# EAGLE design SinclairScientific (EAGLE 9.2.0)
AUTHOR: w. boyett; CONTACT_COMPANY: Pacific Light & Hologram; LICENSE: CC-BY-SA; REV: 1C

## Sheet 1 of 2
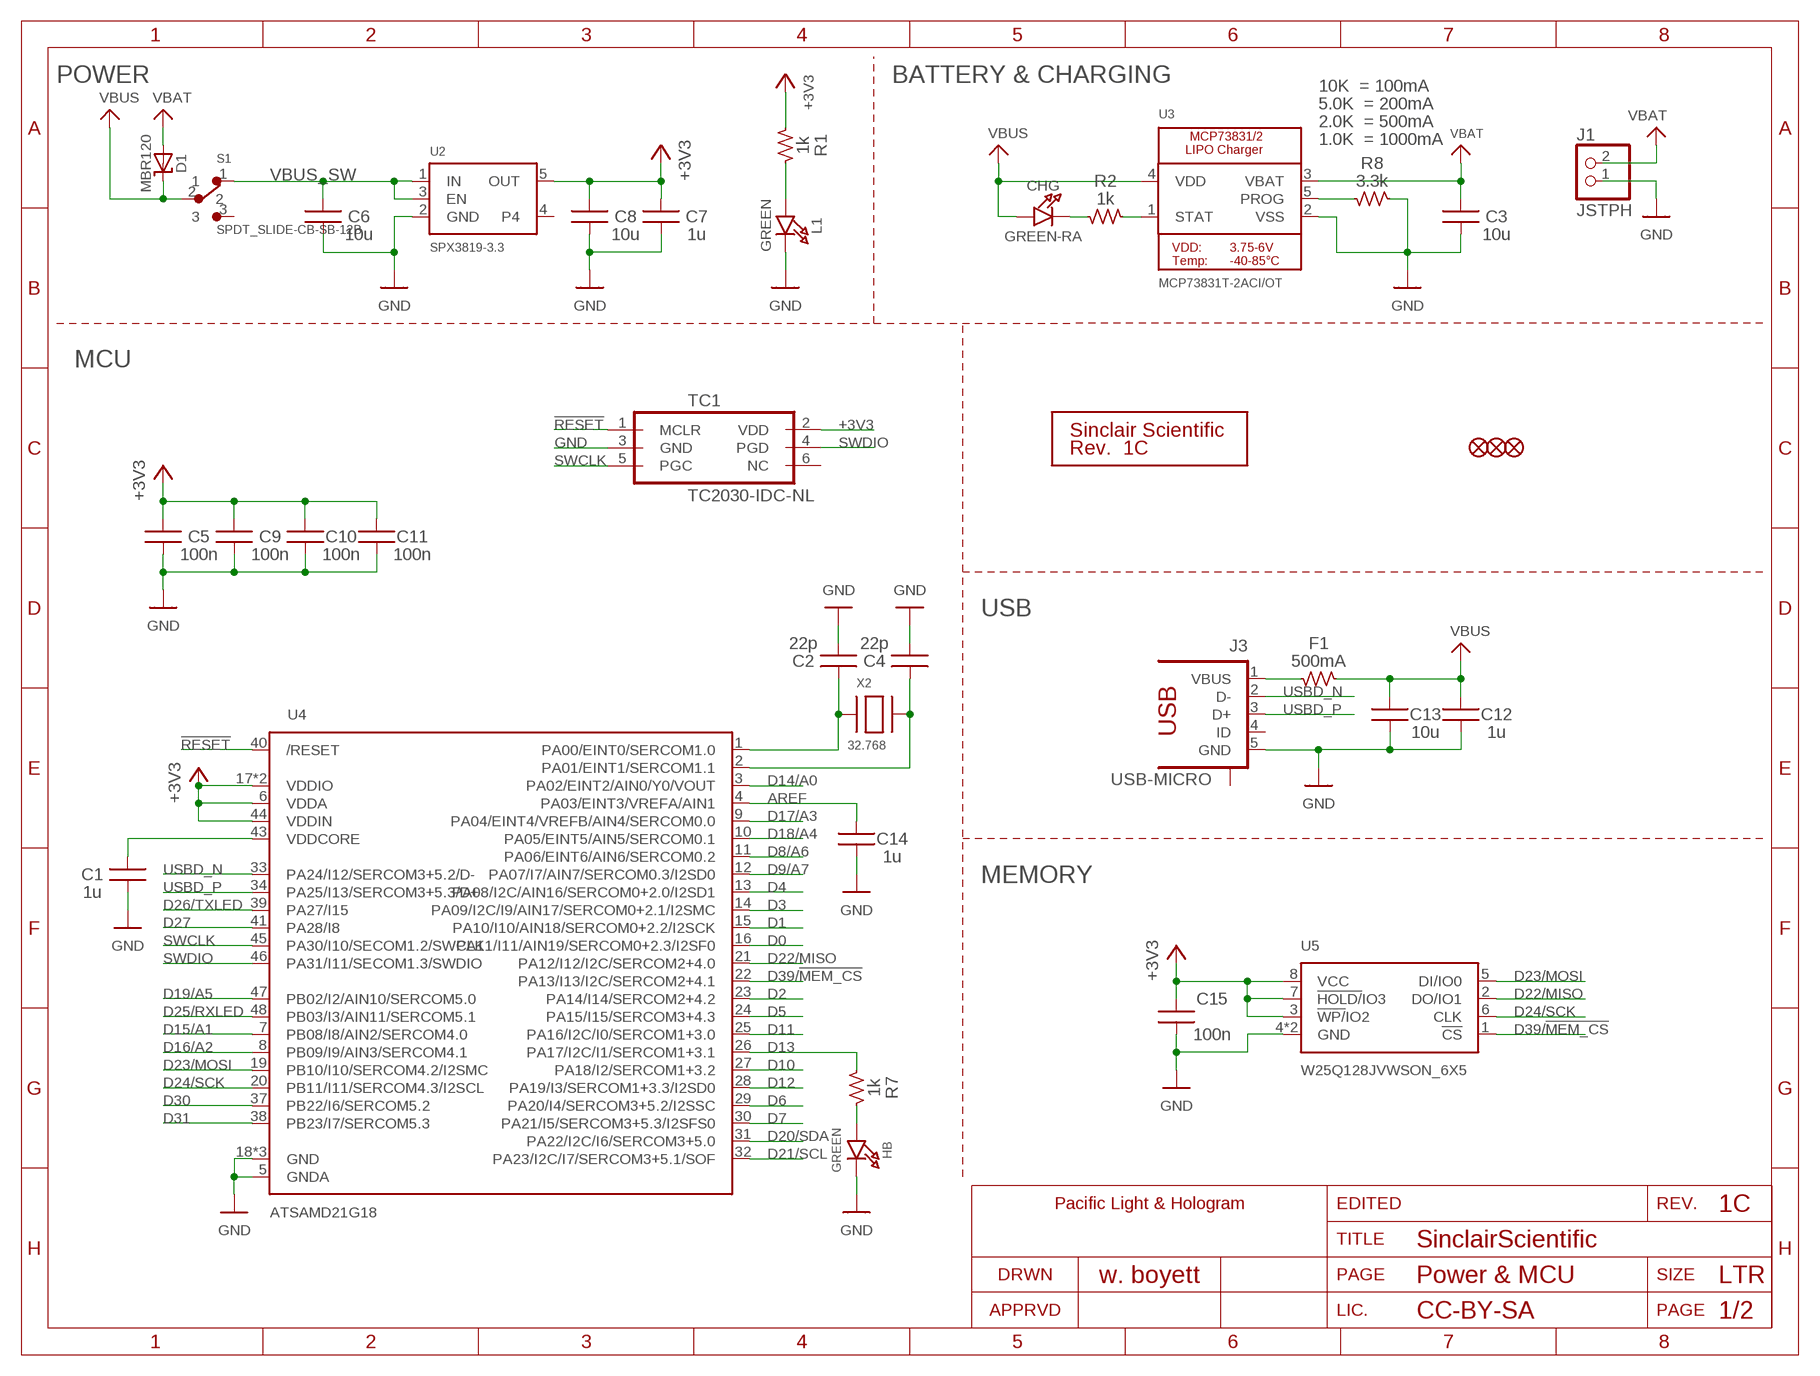
[diagram p0: schematic, sheet 1]
FRAME1 (LETTER_L): SECTION: Power & MCU

### Parts
C1  1u  C-USC0603  [C0603]
C2  22p  C-USC0603  [C0603]
C3  10u  C-USC0805  [C0805]
C4  22p  C-USC0603  [C0603]
C5  100n  C-USC0603  [C0603]
C6  10u  C-USC0805  [C0805]
C7  1u  C-USC0603  [C0603]
C8  10u  C-USC0805  [C0805]
C9  100n  C-USC0603  [C0603]
C10  100n  C-USC0603  [C0603]
C11  100n  C-USC0603  [C0603]
C12  1u  C-USC0603  [C0603]
C13  10u  C-USC0805  [C0805]
C14  1u  C-USC0603  [C0603]
C15  100n  C-USC0603  [C0603]
CHG  GREEN-RA  LED0805_NOOUTLINE  [CHIPLED_0805_NOOUTLINE]
D1  MBR120  DIODE-SCHOTTKYSOD-123  [SOD-123]
F1  500mA  R-US_R0805  [R0805]
FID1  FIDUCIAL""  [FIDUCIAL_1MM]
FID2  FIDUCIAL""  [FIDUCIAL_1MM]
FID3  FIDUCIAL""  [FIDUCIAL_1MM]
HB  GREEN  LED0805_NOOUTLINE  [CHIPLED_0805_NOOUTLINE]
J1  JSTPH  CON_JST_PH_2PIN  [JSTPH2]
J3  USB-MICRO  [USB-10118192-0001LF]
L1  GREEN  LED0805_NOOUTLINE  [CHIPLED_0805_NOOUTLINE]
R1  1k  R-US_R0603  [R0603]
R2  1k  R-US_R0603  [R0603]
R7  1k  R-US_R0603  [R0603]
R8  3.3k  R-US_R0603  [R0603]
S1  SPDT_SLIDE-CB-SB-12B  [CL-SB-12B]
SILK-QC  SILK_QC  [SILK_QC]
TC1  TC2030-IDC-NL  [TC2030-IDC-NL]
U2  SPX3819-3.3  VREG_SOT23-5  [SOT23-5]
U3  MCP73831T-2ACI/OT  MCP73831/2  [SOT23-5]
U4  ATSAMD21G18  ATSAMD21J_QFP  [TQFP48_7MM]
U5  W25Q128JVWSON_6X5  [SON127P600X500X80-9N]
X2  32.768  XTAL-3.2X1.5  [XTAL3215]

### Nets
!RESET: TC1.1(MCLR) U4.40(/RESET)
+3V3: C5.1 C7.1 C8.1 C9.1 C10.1 C11.1 C15.1 R1.1 TC1.2(VDD) U2.5(OUT) U4.6(VDDA) U4.17(VDDIO) U4.36(VDDIO) U4.44(VDDIN) U5.3(!WP/!IO2) U5.7(!HOLD/!IO3) U5.8(VCC) ; also sheet 2
AREF: C14.1 U4.4(PA03/EINT3/VREFA/AIN1)
D0: U4.16(PA11/I11/AIN19/SERCOM0+2.3/I2SF0) ; also sheet 2
D1: U4.15(PA10/I10/AIN18/SERCOM0+2.2/I2SCK) ; also sheet 2
D2: U4.23(PA14/I14/SERCOM2+4.2) ; also sheet 2
D3: U4.14(PA09/I2C/I9/AIN17/SERCOM0+2.1/I2SMC) ; also sheet 2
D4: U4.13(PA08/I2C/AIN16/SERCOM0+2.0/I2SD1) ; also sheet 2
D5: U4.24(PA15/I15/SERCOM3+4.3) ; also sheet 2
D6: U4.29(PA20/I4/SERCOM3+5.2/I2SSC) ; also sheet 2
D7: U4.30(PA21/I5/SERCOM3+5.3/I2SFS0) ; also sheet 2
D8/A6: U4.11(PA06/EINT6/AIN6/SERCOM0.2) ; also sheet 2
D9/A7: U4.12(PA07/I7/AIN7/SERCOM0.3/I2SD0) ; also sheet 2
D10: U4.27(PA18/I2/SERCOM1+3.2) ; also sheet 2
D11: U4.25(PA16/I2C/I0/SERCOM1+3.0) ; also sheet 2
D12: U4.28(PA19/I3/SERCOM1+3.3/I2SD0) ; also sheet 2
D13: R7.1 U4.26(PA17/I2C/I1/SERCOM1+3.1)
D14/A0: U4.3(PA02/EINT2/AIN0/Y0/VOUT) ; also sheet 2
D15/A1: U4.7(PB08/I8/AIN2/SERCOM4.0) ; also sheet 2
D16/A2: U4.8(PB09/I9/AIN3/SERCOM4.1) ; also sheet 2
D17/A3: U4.9(PA04/EINT4/VREFB/AIN4/SERCOM0.0) ; also sheet 2
D18/A4: U4.10(PA05/EINT5/AIN5/SERCOM0.1) ; also sheet 2
D19/A5: U4.47(PB02/I2/AIN10/SERCOM5.0) ; also sheet 2
D20/SDA: U4.31(PA22/I2C/I6/SERCOM3+5.0)
D21/SCL: U4.32(PA23/I2C/I7/SERCOM3+5.1/SOF)
D22/MISO: U4.21(PA12/I12/I2C/SERCOM2+4.0) U5.2(DO/IO1)
D23/MOSI: U4.19(PB10/I10/SERCOM4.2/I2SMC) U5.5(DI/IO0)
D24/SCK: U4.20(PB11/I11/SERCOM4.3/I2SCL) U5.6(CLK)
D25/RXLED: U4.48(PB03/I3/AIN11/SERCOM5.1)
D26/TXLED: U4.39(PA27/I15)
D27: U4.41(PA28/I8)
D30: U4.37(PB22/I6/SERCOM5.2)
D31: U4.38(PB23/I7/SERCOM5.3)
D39/!MEM_CS: U4.22(PA13/I13/I2C/SERCOM2+4.1) U5.1(!CS)
EXTAL32: C2.1 U4.1(PA00/EINT0/SERCOM1.0) X2.P$1
GND: C1.2 C2.2 C3.2 C4.2 C5.2 C6.2 C7.2 C8.2 C9.2 C10.2 C11.2 C12.2 C13.2 C14.2 C15.2 HB.C J1.1 J3.5(GND) L1.C R8.2 TC1.3(GND) U2.2(GND) U3.2(VSS) U4.5(GNDA) U4.18(GND) U4.35(GND) U4.42(GND) U5.4(GND) U5.9(GND) ; also sheet 2
N$1: CHG.C R2.1
N$2: HB.A R7.2
N$3: R2.2 U3.1(STAT)
N$4: R8.1 U3.5(PROG)
N$6: L1.A R1.2
N$8: F1.1 J3.1(VBUS)
SWCLK: TC1.5(PGC) U4.45(PA30/I10/SECOM1.2/SWCLK)
SWDIO: TC1.4(PGD) U4.46(PA31/I11/SECOM1.3/SWDIO)
USBD_N: J3.2(D-) U4.33(PA24/I12/SERCOM3+5.2/D-)
USBD_P: J3.3(D+) U4.34(PA25/I13/SERCOM3+5.3/D+)
VBAT: C3.1 D1.A J1.2 U3.3(VBAT)
VBUS: C12.1 C13.1 CHG.A D1.C F1.2 S1.2 U3.4(VDD)
VBUS_SW: C6.1 S1.1 U2.1(IN) U2.3(EN)
VDDCORE: C1.1 U4.43(VDDCORE)
XTAL32: C4.1 U4.2(PA01/EINT1/SERCOM1.1) X2.P$2
Unconnected: J3.4(ID) J3.M1(S) J3.M2(S) J3.S1(S) J3.S2(S) J3.S3(S) J3.S4(S) S1.3 TC1.6(NC) U2.4

### Notes on the sheet
- POWER | BATTERY & CHARGING
- 10K  = 100mA
- 5.0K  = 200mA
- 2.0K  = 500mA
- 1.0K  = 1000mA
- MCU
- USB
- MEMORY

## Sheet 2 of 2
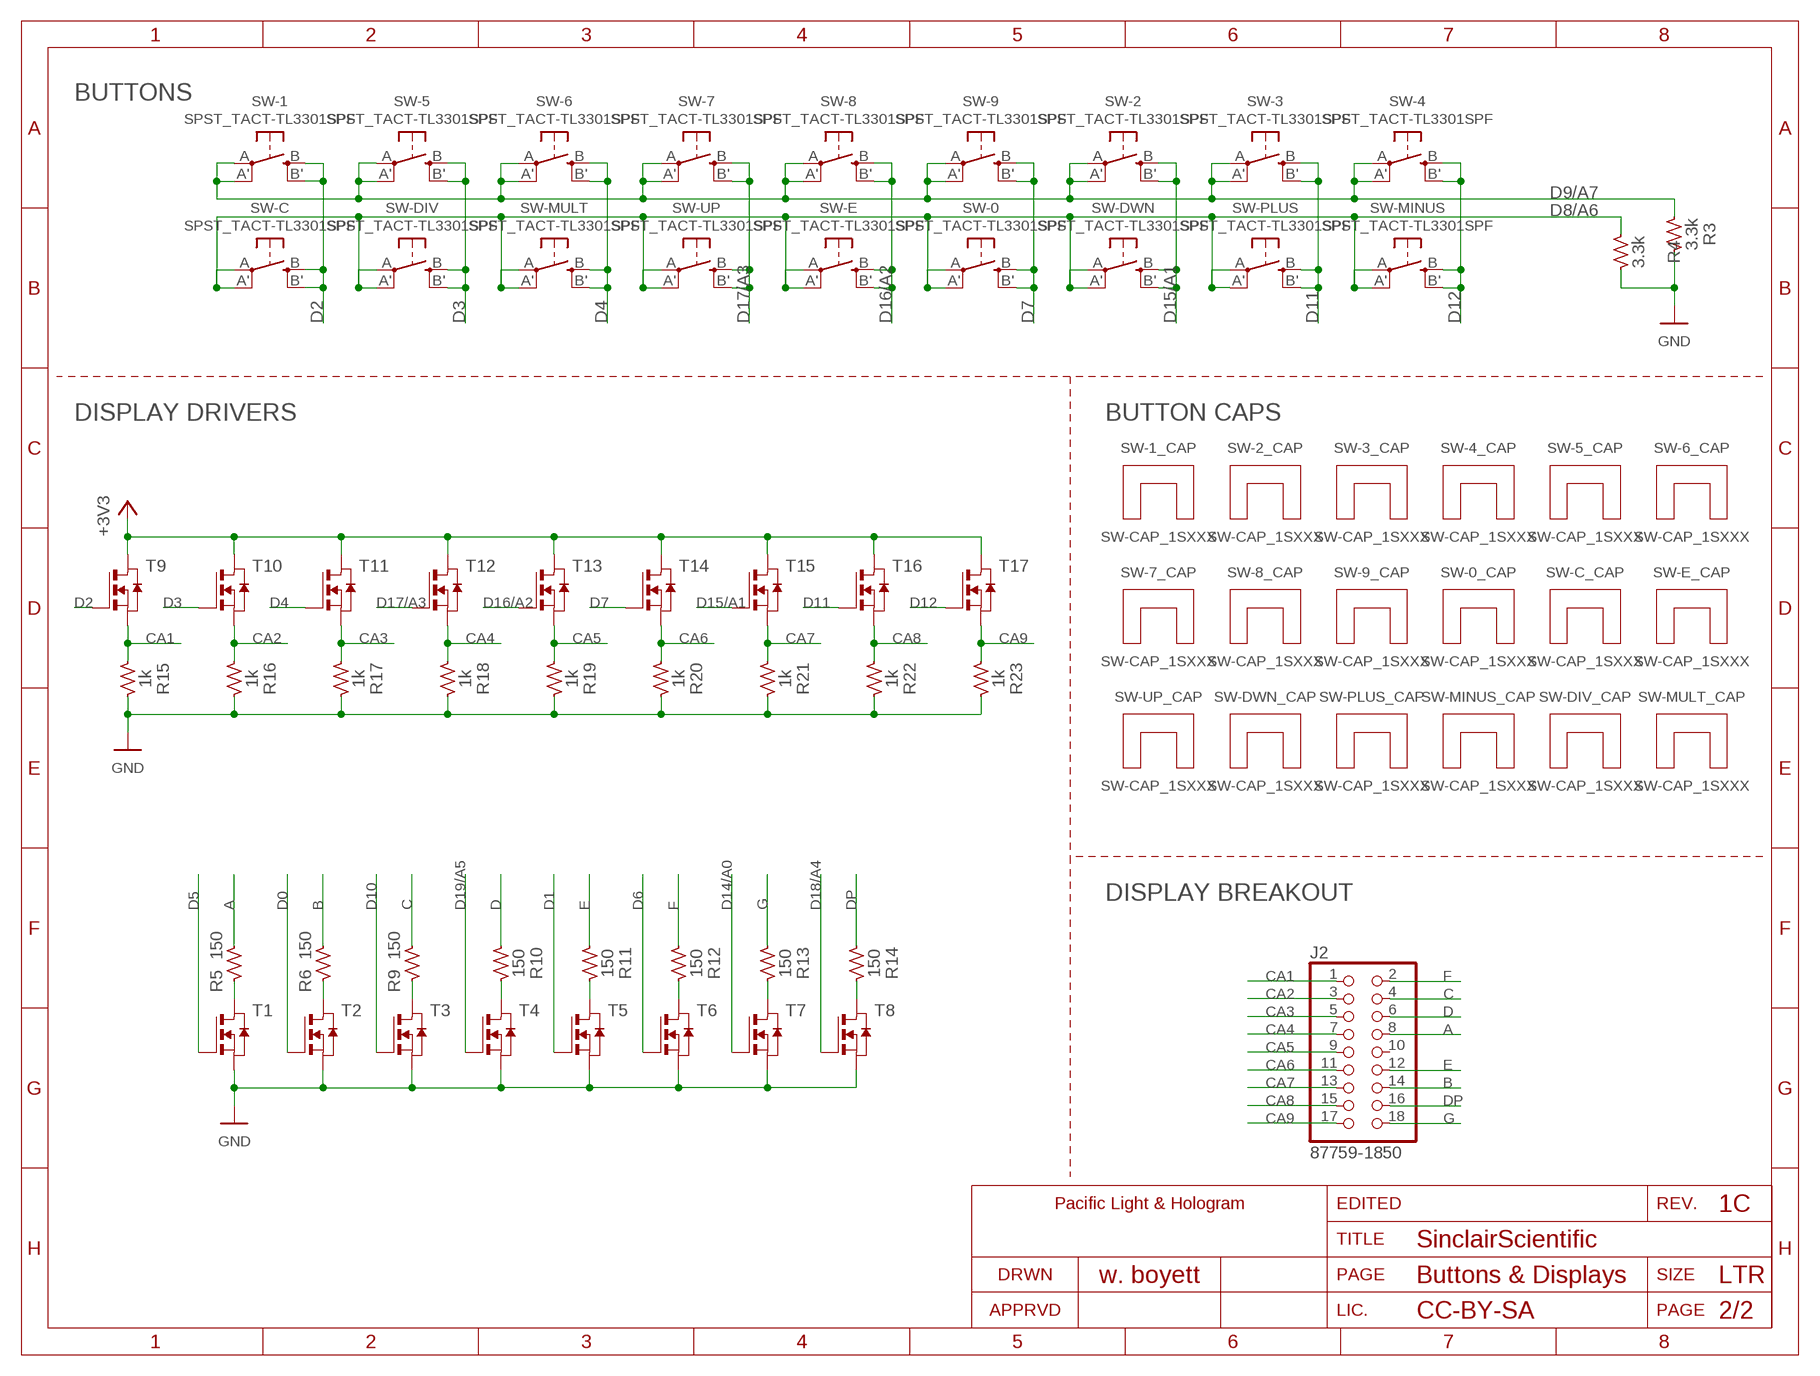
[diagram p1: schematic, sheet 2]
FRAME2 (LETTER_L): SECTION: Buttons & Displays

### Parts
J2  87759-1850  PINHD-2X9-2MM-SMD  [2X09-2MM-SMD]
R3  3.3k  R-US_R0603  [R0603]
R4  3.3k  R-US_R0603  [R0603]
R5  150  R-US_R0603  [R0603]
R6  150  R-US_R0603  [R0603]
R9  150  R-US_R0603  [R0603]
R10  150  R-US_R0603  [R0603]
R11  150  R-US_R0603  [R0603]
R12  150  R-US_R0603  [R0603]
R13  150  R-US_R0603  [R0603]
R14  150  R-US_R0603  [R0603]
R15  1k  R-US_R0603  [R0603]
R16  1k  R-US_R0603  [R0603]
R17  1k  R-US_R0603  [R0603]
R18  1k  R-US_R0603  [R0603]
R19  1k  R-US_R0603  [R0603]
R20  1k  R-US_R0603  [R0603]
R21  1k  R-US_R0603  [R0603]
R22  1k  R-US_R0603  [R0603]
R23  1k  R-US_R0603  [R0603]
SW-0  SPST_TACT-TL3301SPF  [TACT_6X6]
SW-0_CAP  SW-CAP_1SXXX  [SW-CAP_1SWXXX]
SW-1  SPST_TACT-TL3301SPF  [TACT_6X6]
SW-1_CAP  SW-CAP_1SXXX  [SW-CAP_1SWXXX]
SW-2  SPST_TACT-TL3301SPF  [TACT_6X6]
SW-2_CAP  SW-CAP_1SXXX  [SW-CAP_1SWXXX]
SW-3  SPST_TACT-TL3301SPF  [TACT_6X6]
SW-3_CAP  SW-CAP_1SXXX  [SW-CAP_1SWXXX]
SW-4  SPST_TACT-TL3301SPF  [TACT_6X6]
SW-4_CAP  SW-CAP_1SXXX  [SW-CAP_1SWXXX]
SW-5  SPST_TACT-TL3301SPF  [TACT_6X6]
SW-5_CAP  SW-CAP_1SXXX  [SW-CAP_1SWXXX]
SW-6  SPST_TACT-TL3301SPF  [TACT_6X6]
SW-6_CAP  SW-CAP_1SXXX  [SW-CAP_1SWXXX]
SW-7  SPST_TACT-TL3301SPF  [TACT_6X6]
SW-7_CAP  SW-CAP_1SXXX  [SW-CAP_1SWXXX]
SW-8  SPST_TACT-TL3301SPF  [TACT_6X6]
SW-8_CAP  SW-CAP_1SXXX  [SW-CAP_1SWXXX]
SW-9  SPST_TACT-TL3301SPF  [TACT_6X6]
SW-9_CAP  SW-CAP_1SXXX  [SW-CAP_1SWXXX]
SW-C  SPST_TACT-TL3301SPF  [TACT_6X6]
SW-C_CAP  SW-CAP_1SXXX  [SW-CAP_1SWXXX]
SW-DIV  SPST_TACT-TL3301SPF  [TACT_6X6]
SW-DIV_CAP  SW-CAP_1SXXX  [SW-CAP_1SWXXX]
SW-DWN  SPST_TACT-TL3301SPF  [TACT_6X6]
SW-DWN_CAP  SW-CAP_1SXXX  [SW-CAP_1SWXXX]
SW-E  SPST_TACT-TL3301SPF  [TACT_6X6]
SW-E_CAP  SW-CAP_1SXXX  [SW-CAP_1SWXXX]
SW-MINUS  SPST_TACT-TL3301SPF  [TACT_6X6]
SW-MINUS_CAP  SW-CAP_1SXXX  [SW-CAP_1SWXXX]
SW-MULT  SPST_TACT-TL3301SPF  [TACT_6X6]
SW-MULT_CAP  SW-CAP_1SXXX  [SW-CAP_1SWXXX]
SW-PLUS  SPST_TACT-TL3301SPF  [TACT_6X6]
SW-PLUS_CAP  SW-CAP_1SXXX  [SW-CAP_1SWXXX]
SW-UP  SPST_TACT-TL3301SPF  [TACT_6X6]
SW-UP_CAP  SW-CAP_1SXXX  [SW-CAP_1SWXXX]
T1  NMOSSOT23-FDV303N  [SOT-23]
T2  NMOSSOT23-FDV303N  [SOT-23]
T3  NMOSSOT23-FDV303N  [SOT-23]
T4  NMOSSOT23-FDV303N  [SOT-23]
T5  NMOSSOT23-FDV303N  [SOT-23]
T6  NMOSSOT23-FDV303N  [SOT-23]
T7  NMOSSOT23-FDV303N  [SOT-23]
T8  NMOSSOT23-FDV303N  [SOT-23]
T9  NMOSSOT23-FDV303N  [SOT-23]
T10  NMOSSOT23-FDV303N  [SOT-23]
T11  NMOSSOT23-FDV303N  [SOT-23]
T12  NMOSSOT23-FDV303N  [SOT-23]
T13  NMOSSOT23-FDV303N  [SOT-23]
T14  NMOSSOT23-FDV303N  [SOT-23]
T15  NMOSSOT23-FDV303N  [SOT-23]
T16  NMOSSOT23-FDV303N  [SOT-23]
T17  NMOSSOT23-FDV303N  [SOT-23]

### Nets
+3V3: T9.1(D) T10.1(D) T11.1(D) T12.1(D) T13.1(D) T14.1(D) T15.1(D) T16.1(D) T17.1(D) ; also sheet 1
A: J2.8 R5.1
B: J2.14 R6.1
C: J2.4 R9.1
CA1: J2.1 R15.1 T9.2(S)
CA2: J2.3 R16.1 T10.2(S)
CA3: J2.5 R17.1 T11.2(S)
CA4: J2.7 R18.1 T12.2(S)
CA5: J2.9 R19.1 T13.2(S)
CA6: J2.11 R20.1 T14.2(S)
CA7: J2.13 R21.1 T15.2(S)
CA8: J2.15 R22.1 T16.2(S)
CA9: J2.17 R23.1 T17.2(S)
D: J2.6 R10.1
D0: T2.3(G) ; also sheet 1
D1: T5.3(G) ; also sheet 1
D2: SW-1.B'(S1) SW-1.B(S) SW-C.B'(S1) SW-C.B(S) T9.3(G) ; also sheet 1
D3: SW-5.B'(S1) SW-5.B(S) SW-DIV.B'(S1) SW-DIV.B(S) T10.3(G) ; also sheet 1
D4: SW-6.B'(S1) SW-6.B(S) SW-MULT.B'(S1) SW-MULT.B(S) T11.3(G) ; also sheet 1
D5: T1.3(G) ; also sheet 1
D6: T6.3(G) ; also sheet 1
D7: SW-0.B'(S1) SW-0.B(S) SW-9.B'(S1) SW-9.B(S) T14.3(G) ; also sheet 1
D8/A6: R4.1 SW-0.A'(P1) SW-0.A(P) SW-C.A'(P1) SW-C.A(P) SW-DIV.A'(P1) SW-DIV.A(P) SW-DWN.A'(P1) SW-DWN.A(P) SW-E.A'(P1) SW-E.A(P) SW-MINUS.A'(P1) SW-MINUS.A(P) SW-MULT.A'(P1) SW-MULT.A(P) SW-PLUS.A'(P1) SW-PLUS.A(P) SW-UP.A'(P1) SW-UP.A(P) ; also sheet 1
D9/A7: R3.1 SW-1.A'(P1) SW-1.A(P) SW-2.A'(P1) SW-2.A(P) SW-3.A'(P1) SW-3.A(P) SW-4.A'(P1) SW-4.A(P) SW-5.A'(P1) SW-5.A(P) SW-6.A'(P1) SW-6.A(P) SW-7.A'(P1) SW-7.A(P) SW-8.A'(P1) SW-8.A(P) SW-9.A'(P1) SW-9.A(P) ; also sheet 1
D10: T3.3(G) ; also sheet 1
D11: SW-3.B'(S1) SW-3.B(S) SW-PLUS.B'(S1) SW-PLUS.B(S) T16.3(G) ; also sheet 1
D12: SW-4.B'(S1) SW-4.B(S) SW-MINUS.B'(S1) SW-MINUS.B(S) T17.3(G) ; also sheet 1
D14/A0: T7.3(G) ; also sheet 1
D15/A1: SW-2.B'(S1) SW-2.B(S) SW-DWN.B'(S1) SW-DWN.B(S) T15.3(G) ; also sheet 1
D16/A2: SW-8.B'(S1) SW-8.B(S) SW-E.B'(S1) SW-E.B(S) T13.3(G) ; also sheet 1
D17/A3: SW-7.B'(S1) SW-7.B(S) SW-UP.B'(S1) SW-UP.B(S) T12.3(G) ; also sheet 1
D18/A4: T8.3(G) ; also sheet 1
D19/A5: T4.3(G) ; also sheet 1
DP: J2.16 R14.1
E: J2.12 R11.1
F: J2.2 R12.1
G: J2.18 R13.1
GND: R3.2 R4.2 R15.2 R16.2 R17.2 R18.2 R19.2 R20.2 R21.2 R22.2 R23.2 T1.2(S) T2.2(S) T3.2(S) T4.2(S) T5.2(S) T6.2(S) T7.2(S) T8.2(S) ; also sheet 1
N$9: R5.2 T1.1(D)
N$10: R6.2 T2.1(D)
N$11: R9.2 T3.1(D)
N$12: R10.2 T4.1(D)
N$13: R11.2 T5.1(D)
N$14: R12.2 T6.1(D)
N$15: R13.2 T7.1(D)
N$16: R14.2 T8.1(D)
Unconnected: J2.10

### Notes on the sheet
- BUTTONS
- DISPLAY DRIVERS | BUTTON CAPS
- DISPLAY BREAKOUT

## Library data of the parts
C1 C7 C12 C14 = SinclairScientific:C-US: CAPACITOR, American symbol; MFG: TDK Corporation; MPN: C1608X7R1C105M080AC; PN-DK: 445-5131-1-ND
C2 C4 = SinclairScientific:C-US: CAPACITOR, American symbol; MFG: Murata Electronics North America; MPN: GQM1875C2E220JB12D; PN-DK: 490-16699-1-ND
C3 C6 C8 C13 = SinclairScientific:C-US: CAPACITOR, American symbol; MFG: Murata Electronics North America; MPN: GRM21BR61C106KE15K; PN-DK: 490-6473-1-ND
C5 C9-C11 C15 = SinclairScientific:C-US: CAPACITOR, American symbol; MFG: AVX Corporation; MPN: 06035C104K4Z4A; PN-DK: 478-10679-1-ND
CHG = SinclairScientific:LED: LED 0603 - 0603 Surface Mount Package 2mA: Green LED - Low Power (3.9mcd, 2ma, 1.7Vf) - Digikey: 475-2709-2-ND Orange LED - Low Power (9.8mcd, 2ma, 1.8Vf) - Digikey: 475-1194-2-ND Red LED - Low Power (5mcd, 2ma, 1.8Vf) - Digikey: 475-1195-2-ND Yellow LED - Low Power (7mcd, 2ma, 1.8Vf) - Digikey: 475-1196-2-ND 5mA: Blue LED - Low Power (17mcd, 5ma, 2.9Vf) - Digikey: LNJ937W8CRACT-ND 0805 - 0805 Surface Mount Package 2mA: Red LED (8.8mcd, 2mA, 1.8Vf, Clear) - Low Power [Digikey: 475-2510-1-ND] Green LED (5mcd, 2mA, 1.8Vf, Clear) - Low Power [Digikey: 475-2730-1-ND] Yellow LED (11.3mcd, 2mA, 1.8Vf, Clear) - Low Power [Digikey: 475-2555-1-ND] 20mA: Red LED (104mcd, 20mA, Diffused) - LS R976 [Digikey: 475-1278-6-ND] Red LED (12mcd, 20mA, 2.0Vf, Clear) - APT2012EC [Digikey: 754-1128-1-ND] Green LED (15mcd, 20mA, 2.2Vf, Clear) - APT2012GC [Digikey: 754-1131-1-ND] Orange LED (160mcd, 20mA, 2.1Vf, Clear) - APT2012SECK [Digikey: 754-1130-1-ND] 1206 - 1206 Surface Mount Package Green LED (26mcd, 20mA, Diffused) - LG N971 [Digikey: 475-1407-6-ND] Red LED (15mcd, 20mA, Diffused) - LH N974 [Digikey: 475-1416-6-ND] Cree - Cree High-Power Surface Mount LEDs XPEBWT-L1-0000-00D50 - White 111lm 350mA 2.9Vf 6200K 110° XTEAWT-00-0000-00000LEE3 - White 114lm 350mA 2.85Vf 5000K 115° Everlight - Everlight 45-21 Series Surface Mount LEDs 45-21/QK2C-B2832AC2CB2/2T - Warm White 2000mcd 20mA 3.25Vf 3050K 120° 45-21/LK2C-B38452C4CB2/2T - Nuetral White 2000mcd 20mA 3.25Vf 4150K 120° 45-21/LK2C-B50634C6CB2/2T - Cold White 2200mcd 20mA 3.25Vf 5650K 120° PLCC2 Reverse Mount LS T77K-J1L2-1-0-2-R18-Z - Red 11.25mcd 2mA 1.8Vf 630nm 120° LO T77K-L1M2-24-Z - Orange 19.6mcd 2mA 1.8Vf 606nm 120° LY T77K-K2M1-26-Z - Yellow 15.7mcd 2mA 1.8Vf 587nm 120°; MFG: Lite-On Inc.; MPN: LTST-S220KGKT; PN-DK: 160-1468-1-ND
D1 = SinclairScientific:DIODE-SCHOTTKY; MFG: ON Semiconductor; MPN: MBR120VLSFT1G; PN-DK: MBR120VLSFT1GOSCT-ND
F1 = SinclairScientific:R-US_: RESISTOR, American symbol; MFG: Bel Fuse Inc.; MPN: 0ZCK0050FF2E; PN-DK: 507-1813-1-ND
FID1-FID3 = SinclairScientific:FIDUCIAL: Fiducial Alignment Points Various fiducial points for machine vision alignment.; DNP: DNP
HB L1 = SinclairScientific:LED: LED 0603 - 0603 Surface Mount Package 2mA: Green LED - Low Power (3.9mcd, 2ma, 1.7Vf) - Digikey: 475-2709-2-ND Orange LED - Low Power (9.8mcd, 2ma, 1.8Vf) - Digikey: 475-1194-2-ND Red LED - Low Power (5mcd, 2ma, 1.8Vf) - Digikey: 475-1195-2-ND Yellow LED - Low Power (7mcd, 2ma, 1.8Vf) - Digikey: 475-1196-2-ND 5mA: Blue LED - Low Power (17mcd, 5ma, 2.9Vf) - Digikey: LNJ937W8CRACT-ND 0805 - 0805 Surface Mount Package 2mA: Red LED (8.8mcd, 2mA, 1.8Vf, Clear) - Low Power [Digikey: 475-2510-1-ND] Green LED (5mcd, 2mA, 1.8Vf, Clear) - Low Power [Digikey: 475-2730-1-ND] Yellow LED (11.3mcd, 2mA, 1.8Vf, Clear) - Low Power [Digikey: 475-2555-1-ND] 20mA: Red LED (104mcd, 20mA, Diffused) - LS R976 [Digikey: 475-1278-6-ND] Red LED (12mcd, 20mA, 2.0Vf, Clear) - APT2012EC [Digikey: 754-1128-1-ND] Green LED (15mcd, 20mA, 2.2Vf, Clear) - APT2012GC [Digikey: 754-1131-1-ND] Orange LED (160mcd, 20mA, 2.1Vf, Clear) - APT2012SECK [Digikey: 754-1130-1-ND] 1206 - 1206 Surface Mount Package Green LED (26mcd, 20mA, Diffused) - LG N971 [Digikey: 475-1407-6-ND] Red LED (15mcd, 20mA, Diffused) - LH N974 [Digikey: 475-1416-6-ND] Cree - Cree High-Power Surface Mount LEDs XPEBWT-L1-0000-00D50 - White 111lm 350mA 2.9Vf 6200K 110° XTEAWT-00-0000-00000LEE3 - White 114lm 350mA 2.85Vf 5000K 115° Everlight - Everlight 45-21 Series Surface Mount LEDs 45-21/QK2C-B2832AC2CB2/2T - Warm White 2000mcd 20mA 3.25Vf 3050K 120° 45-21/LK2C-B38452C4CB2/2T - Nuetral White 2000mcd 20mA 3.25Vf 4150K 120° 45-21/LK2C-B50634C6CB2/2T - Cold White 2200mcd 20mA 3.25Vf 5650K 120° PLCC2 Reverse Mount LS T77K-J1L2-1-0-2-R18-Z - Red 11.25mcd 2mA 1.8Vf 630nm 120° LO T77K-L1M2-24-Z - Orange 19.6mcd 2mA 1.8Vf 606nm 120° LY T77K-K2M1-26-Z - Yellow 15.7mcd 2mA 1.8Vf 587nm 120°; MFG: Lite-On Inc.; MPN: LTST-C170GKT; PN-DK: 160-1179-1-ND
J1 = SinclairScientific:CON_JST_PH_2PIN: JST 2-Pin Right-Angle Connector PH-Series - 4UConnector: 17311 SH-Series - 4UConnector: 07278; MFG: JST Sales America Inc.; MPN: S2B-PH-SM4-TB(LF)(SN); PN-DK: 455-1749-1-ND
J2 = SinclairScientific:PINHD-2X9: PIN HEADER; MFG: Molex; MPN: 87759-1850; PN-DK: WM18656-ND
J3 = SinclairScientific:USB-MICRO: CONN USB MICRO B RECPT SMT R/A; MFG: Amphenol; MPN: 10118192-0001LF; PN-DK: 609-4613-1-ND
R1 R2 R7 R15-R23 = SinclairScientific:R-US_: RESISTOR, American symbol; MFG: Yageo; MPN: RC0603FR-071KL; PN-DK: 311-1.00KHRCT-ND
R3 R4 R8 = SinclairScientific:R-US_: RESISTOR, American symbol; MFG: Yageo; MPN: RC0603FR-073K3L; PN-DK: 311-3.30KHRCT-ND
R5 R6 R9-R14 = SinclairScientific:R-US_: RESISTOR, American symbol; MFG: Yageo; MPN: RC0603FR-07150RL; PN-DK: 311-150HRCT-ND
S1 = SinclairScientific:SPDT_SLIDE: Switch, Slide, PC Terminal, SPST, ON-NONE-OFF, 0.4VA MAX@120VAC OR VDC MAX; MFG: Nidec Copal Electronics; MPN: CL-SB-12B-01T; PN-DK: 563-1318-1-ND
SILK-QC = SinclairScientific:SILK_QC: Model/Version Tag Silkscreen; DNP: DNP; PRODUCT: Sinclair Scientific; REV: 1C
SW-0 SW-1-SW-9 SW-C SW-DIV SW-DWN SW-E SW-MINUS SW-MULT SW-PLUS SW-UP = SinclairScientific:SPST_TACT: Tactile Switch SPST-NO; MFG: E-Switch; MPN: TL3301SPF260QG; PN-DK: EG1870CT-ND
SW-0_CAP SW-1_CAP SW-2_CAP SW-3_CAP SW-4_CAP SW-5_CAP SW-6_CAP SW-7_CAP SW-8_CAP SW-9_CAP SW-C_CAP SW-DIV_CAP SW-DWN_CAP SW-E_CAP SW-MINUS_CAP SW-MULT_CAP SW-PLUS_CAP SW-UP_CAP = SinclairScientific:SW-CAP_1SXXX: CAP PUSHBUTTON SQUARE; MFG: E-Switch; MPN: 1SWHT; PN-DK: EG4365-ND
T1-T17 = SinclairScientific:NMOSSOT23: MOS FET; MFG: ON Semiconductor; MPN: FDV303N; PN-DK: FDV303NCT-ND
TC1 = SinclairScientific:TC2030-IDC: Tag-Connect In Circuit Programming & Debug Cable 6 Pin http://www.tag-connect.com; MFG: Tag-Connect; MPN: TC2030-IDC-NL; PN-DK: TC2030-IDC-NL
U2 = SinclairScientific:VREG_SOT23-5: SOT23-5 Fixed Voltage Regulators Part Current Out V Out V In V Dropout θJA (°C/W) TJ (°C) Digikey Part No. ADP121 150mA 3.3V 3.4-5.5V 0.09V @ 150mA -- -- ADP121-AUJZ33R7CT-ND ADP121 150mA 3.0V 3.1-5.5V 0.09V @ 150mA -- -- ADP121-AUJZ30R7CT-ND ADP122 300mA 3.3V 3.4-5.5V 0.085V @ 300mA -- -- ADP122AUJZ-3.3-R7CT-ND ADP1712 300mA 3.3V 3.5-5.5V 0.17V @ 300mA -- -- ADP1712AUJZ-3.3-R7TR-ND AP7311 (Low Cost) 150mA 3.3V 3.5-6V 0.15V @ 150mA -- -- AP7311-33WG-7DICT-ND LD39015M18R 150mA 1.8V 1.9V-5.5V 0.08V @ 100mA -- -- 497-6977-1-ND LP2985A-33DBVR 150mA 3.3V 3.3-16V 0.28V @ 150mA 206 150 296-18479-1-ND MCP1824T-3302E/OT 300mA 3.3V 3.5V-6V 0.2V @ 300mA -- -- MCP1824T-3302E/OTCT-ND MIC5205-2.5YM5 TR 150mA 2.5V 2.7-16V 0.165V @ 150mA -- -- 576-1257-2-ND MIC5205-3.0YM5 TR 150mA 3.0V 3.2V-16V 0.165V @ 150mA -- -- 576-1258-2-ND MIC5205-3.3YM5 TR 150mA 3.3V 3.5V-16V 0.165V @ 150mA -- -- 576-1259-2-ND TPS780330220 150mA 3.3V+2.2V 3.6-5.5V 250mV Max -- -- 296-23332-1-ND TDA3663/N1,135 100mA 3.3V 3.5-45V 0.18V @ 50mA -- -- 568-5343-1-ND Max operating temp can be calculated using θJA, TJ (max junction temperature), and power in watts. Set the "Maximum Ambient Temperature" until it reaches TJ ("Max Junction Temperature"), which is the absolute limit for safe use of the regulator: Heat Sink Temperature Calculator <http://www.daycounter.com/Calculators/Heat-Sink-Temperature-Calculator.phtml> For example, With 12V source into a 3.3V LP2985 and a 30mA load, we are dissipating (12V-3.3V) * 0.03A = 0.261W. With a θJA of 206 °C/W, a TJ of 150°C, and 261mW we can safely use the chip without a heat sink up to 75°C (=147.1°C Junction Temperature).; MFG: MaxLinear, Inc.; MPN: SPX3819M5-L-3-3/TR; PN-DK: 1016-1873-1-ND
U3 = SinclairScientific:MCP73831/2: MCP73831/2 LIPO Charger VDD: 3.75 - 6V Temp -40 - 85°C Programmable Charge Rate: 15-500mA NOTE: STAT is a tri-state logic output on the MCP73831 and an open-drain output on the MCP73832. SOT23-5 with 4.2V output and tri-state logic on STAT = MCP73831T-2ACI/OT; MFG: Microchip Technology; MPN: MCP73831T-2ACI/OT; PN-DK: MCP73831T-2ACI/OTCT-ND
U4 = SinclairScientific:ATSAMD21J: ARM® Cortex®-M0+ SAM D21G Microcontroller IC 32-Bit 48MHz 256KB (256K x 8) FLASH; MFG: Microchip Technology; MPN: ATSAMD21G18A-AUT; PN-DK: ATSAMD21G18A-AUTCT-ND
U5 = SinclairScientific:W25Q128JV; MFG: Winbond Electronics; MPN: W25Q128JVPIM; PN-DK: W25Q128JVPIMCT-ND
X2 = SinclairScientific:XTAL: Low cost SMT crystals, no capacitors included http://www.ladyada.net/library/eagle; MFG: ECS Inc.; MPN: ECS-.327-12.5-34B-TR; PN-DK: XC1617CT-ND

## Net classes
1 usb_data: width 0.203 mm, drill 0.305 mm, clearance 0.254 mm

## Board
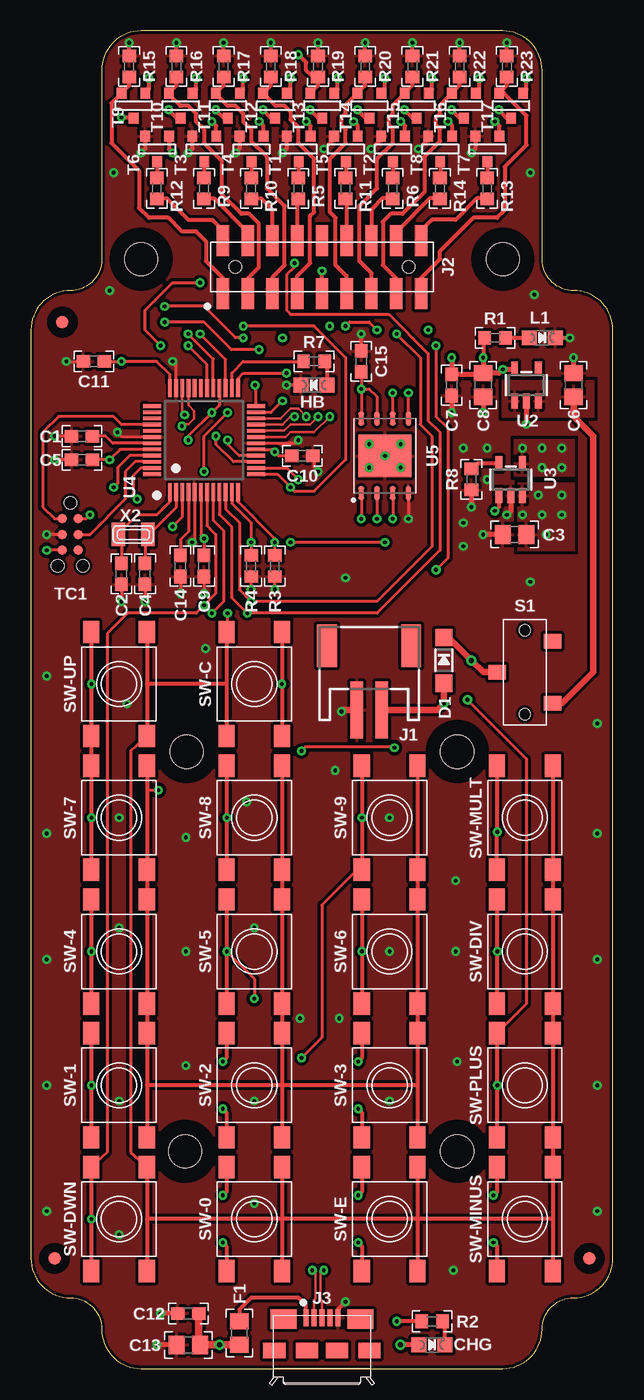
[diagram p2: board, top side]
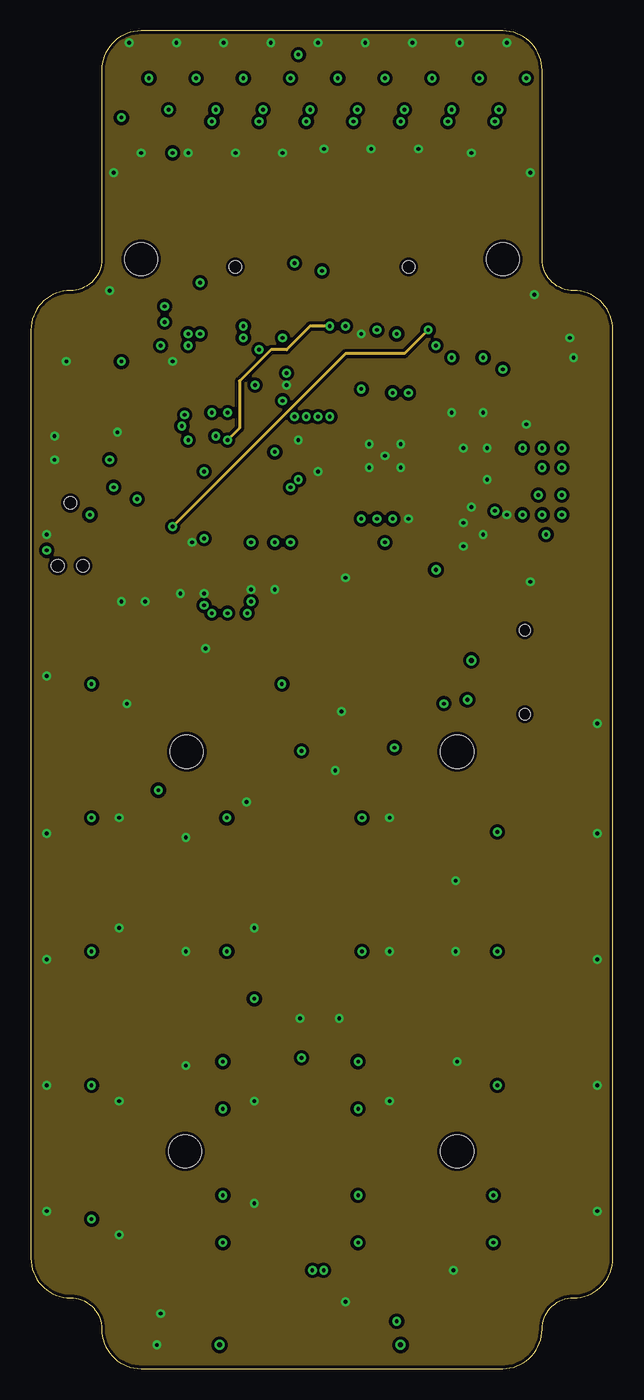
[diagram p3: board, inner layer Route2]
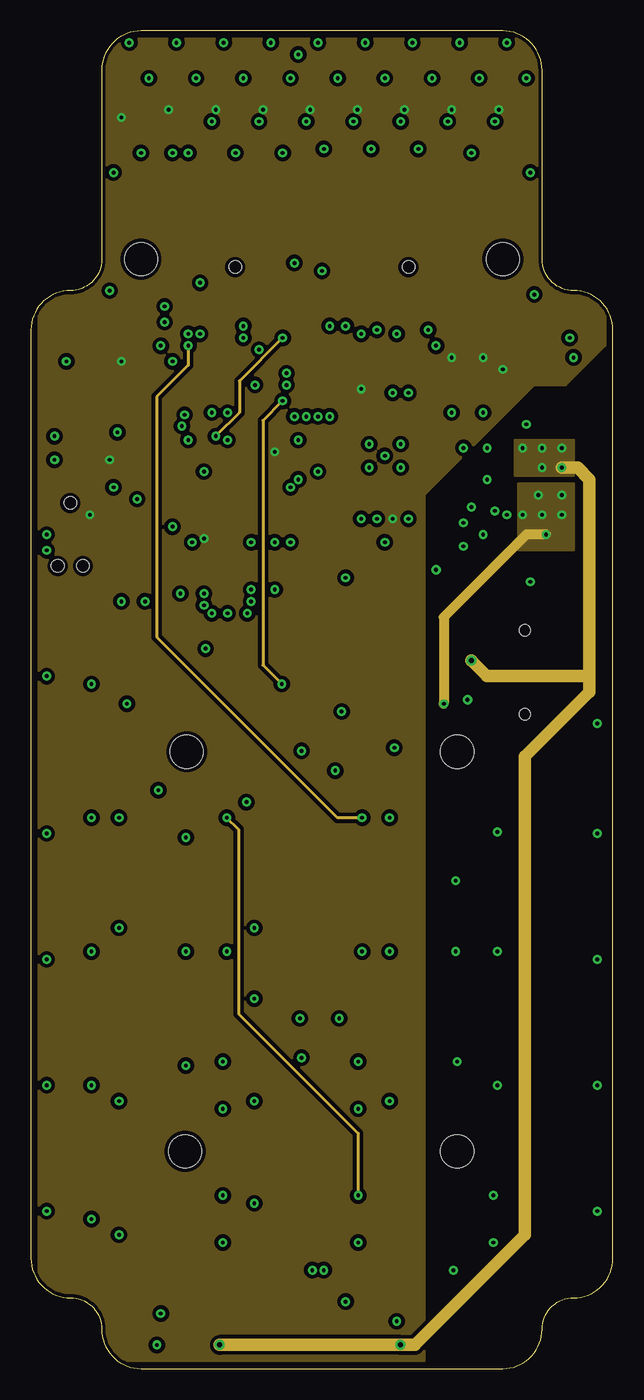
[diagram p4: board, inner layer Route15]
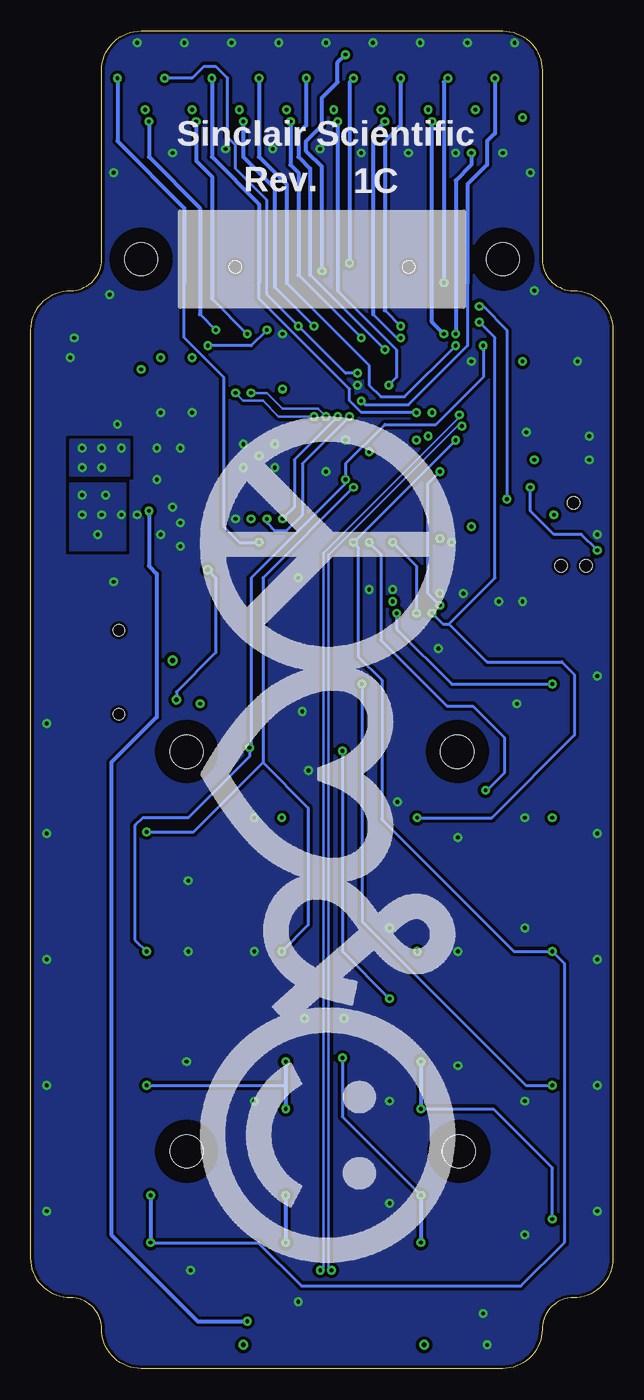
[diagram p5: board, bottom side, seen from below]

Size 46.99 x 107.95 mm. Coordinates in mm from the lower left corner, seen from the top.
Outline: 41.27,3.17 arc-90 43.81,5.71 arc90 46.99,8.89 46.99,83.82 arc90 43.81,87 arc-90 41.27,89.53 41.27,104.78 arc90 38.1,107.95 8.89,107.95 arc90 5.71,104.78 5.71,89.53 arc-90 3.17,87 arc90 0,83.82 0,8.89 arc90 3.17,5.71 arc-90 5.71,3.17 arc90 8.89,0 38.1,0 arc90 41.27,3.17
Copper layers (1*2*15*16): Top 0.035mm / dielectric 0.11mm / Route2 0.035mm / dielectric 0.74mm / Route15 0.035mm / dielectric 0.11mm / Bottom 0.035mm
Design rules "default *": minimum track width 8mil, minimum drill 12mil, track to track 7mil, track to pad 7mil, pad to pad 7mil, via to via 7mil, smd to smd 7mil, copper to edge 10mil, drill to drill 8mil, minimum pad ring 10mil, minimum via ring 8mil, stop-mask expansion 2mil, vias tented up to drill 20mil, thermal gap 10mil

### Footprints (pad centres in the part's own frame; a part is rotated, then mirrored left to right if it is on the bottom)
C0603 = smd 1.1 x 1: 1 -0.85,0; 2 0.85,0
C0805 = smd 1.3 x 1.5: 1 -0.95,0; 2 0.95,0
CHIPLED_0805_NOOUTLINE = smd 1.2 x 1.2: A 0,-1.05; C 0,1.05
SOD-123 = smd 1.4 x 1.4: A 1.85,0; C -1.85,0
R0805 = smd 1.3 x 1.5: 1 -0.95,0; 2 0.95,0
FIDUCIAL_1MM = smd 1 x 1: 1 0,0
JSTPH2 = smd 1 x 4.6: 1 -1,-3.7; 2 1,-3.7 | smd 1.6 x 3.4: NC1 -3.4,1.5; NC2 3.4,1.5
2X09-2MM-SMD = smd 1 x 2.5: 1 -8,-2.13; 2 -8,2.13; 3 -6,-2.13; 4 -6,2.13; 5 -4,-2.13; 6 -4,2.13; 7 -2,-2.13; 8 -2,2.13; 9 0,-2.13; 10 0,2.13; 11 2,-2.13; 12 2,2.13; 13 4,-2.13; 14 4,2.13; 15 6,-2.13; 16 6,2.13; 17 8,-2.13; 18 8,2.13 | hole 1: -7,0; 7,0
USB-10118192-0001LF = smd 0.4 x 1.35: 1 -1.3,4.1; 2 -0.65,4.1; 3 0,4.1; 4 0.65,4.1; 5 1.3,4.1 | smd 1.778 x 1.27: M1 -1.2,1.45; M2 1.2,1.45; S1 -3.85,1.45; S2 3.85,1.45 | smd 2.1 x 1.6: S3 -3.1,4; S4 3.1,4
R0603 = smd 1 x 1.1: 1 -0.85,0; 2 0.85,0
CL-SB-12B = smd 1.2 x 1.4: 1 -2.5,-2.25; 2 0,2.25; 3 2.5,-2.25 | hole 0.9: 3.4,0; -3.4,0
TACT_6X6 = smd 1.8 x 1.3: A -4.2,-2.25; A' 4.2,-2.25; B -4.2,2.25; B' 4.2,2.25
SOT-23 = smd 0.787 x 0.889: 1 0.025,-1.016; 2 -0.94,1.016; 3 0.991,1.016
TC2030-IDC-NL = smd 0.787 x 0.787: 1 -1.27,-0.635; 2 -1.27,0.635; 3 0,-0.635; 4 0,0.635; 5 1.27,-0.635; 6 1.27,0.635 | hole 0.991: -2.54,0; 2.54,1.016; 2.54,-1.016
SOT23-5 = smd 0.55 x 1.2: 1 -0.95,-1.3; 2 0,-1.3; 3 0.95,-1.3; 4 0.95,1.3; 5 -0.95,1.3
TQFP48_7MM = smd 1.45 x 0.3: 1 -4.2,2.75; 2 -4.2,2.25; 3 -4.2,1.75; 4 -4.2,1.25; 5 -4.2,0.75; 6 -4.2,0.25; 7 -4.2,-0.25; 8 -4.2,-0.75; 9 -4.2,-1.25; 10 -4.2,-1.75; 11 -4.2,-2.25; 12 -4.2,-2.75; 25 4.2,-2.75; 26 4.2,-2.25; 27 4.2,-1.75; 28 4.2,-1.25; 29 4.2,-0.75; 30 4.2,-0.25; 31 4.2,0.25; 32 4.2,0.75; 33 4.2,1.25; 34 4.2,1.75; 35 4.2,2.25; 36 4.2,2.75 | smd 0.3 x 1.45: 13 -2.75,-4.2; 14 -2.25,-4.2; 15 -1.75,-4.2; 16 -1.25,-4.2; 17 -0.75,-4.2; 18 -0.25,-4.2; 19 0.25,-4.2; 20 0.75,-4.2; 21 1.25,-4.2; 22 1.75,-4.2; 23 2.25,-4.2; 24 2.75,-4.2; 37 2.75,4.2; 38 2.25,4.2; 39 1.75,4.2; 40 1.25,4.2; 41 0.75,4.2; 42 0.25,4.2; 43 -0.25,4.2; 44 -0.75,4.2; 45 -1.25,4.2; 46 -1.75,4.2; 47 -2.25,4.2; 48 -2.75,4.2
SON127P600X500X80-9N = smd 1.1 x 0.44: 1 -3,1.905; 2 -3,0.635; 3 -3,-0.635; 4 -3,-1.905; 5 3,-1.905; 6 3,-0.635; 7 3,0.635; 8 3,1.905 | smd 3.4 x 4.3: 9 0,0
HOLE_3-48 = hole 2.667: 0,0
XTAL3215 = smd 1.1 x 1.9: P$1 1.2,0; P$2 -1.2,0

### Placement (x,y rotation side)
C1  4.13,75.25 180 top
C2  7.3,64.14 270 top
C3  39.05,67.31 180 top
C4  9.21,64.14 270 top
C5  4.13,73.34 180 top
C6  43.81,79.38 90 top
C7  33.97,79.38 270 top
C8  36.51,79.38 270 top
C9  13.97,64.77 270 top
C10  21.91,73.66 0 top
C11  5.08,81.28 180 top
C12  12.7,4.45 180 top
C13  12.7,1.91 180 top
C14  12.06,64.77 270 top
C15  26.67,81.28 90 top
CHG  32.38,1.91 270 top
D1  33.34,57.15 270 top
F1  16.83,2.86 270 top
FID1  1.91,8.89 0 top
FID2  2.54,84.45 0 top
FID3  45.09,8.89 270 top
HB  22.86,79.38 90 top
J1  27.3,56.83 0 top
J2  23.5,88.9 0 top
J3  23.5,0 0 top
L1  41.27,83.19 270 top
R1  37.47,83.19 0 top
R2  32.38,3.81 180 top
R3  19.68,64.77 270 top
R4  17.78,64.77 270 top
R5  21.59,95.25 90 top
R6  29.21,95.25 90 top
R7  22.86,81.28 0 top
R8  35.56,71.75 270 top
R9  13.97,95.25 90 top
R10  17.78,95.25 90 top
R11  25.4,95.25 90 top
R12  10.16,95.25 90 top
R13  36.83,95.25 90 top
R14  33.02,95.25 90 top
R15  7.94,105.09 90 top
R16  11.75,105.09 90 top
R17  15.56,105.09 90 top
R18  19.37,105.09 90 top
R19  23.18,105.09 90 top
R20  26.99,105.09 90 top
R21  30.8,105.09 90 top
R22  34.61,105.09 90 top
R23  38.42,105.09 90 top
S1  39.88,56.2 90 top
SILK-QC  23.5,94.61 0 bottom
SW-0  18.03,12.06 90 top
SW-0_CAP  18.03,44.45 90 top
SW-1  7.11,22.86 90 top
SW-1_CAP  7.11,12.06 0 top
SW-2  18.03,22.86 90 top
SW-2_CAP  7.11,22.86 90 top
SW-3  28.96,22.86 90 top
SW-3_CAP  7.11,33.66 90 top
SW-4  7.11,33.66 90 top
SW-4_CAP  7.11,44.45 90 top
SW-5  18.03,33.66 90 top
SW-5_CAP  18.03,55.24 90 top
SW-6  28.96,33.66 90 top
SW-6_CAP  39.88,44.45 90 top
SW-7  7.11,44.45 90 top
SW-7_CAP  18.03,12.06 0 top
SW-8  18.03,44.45 90 top
SW-8_CAP  18.03,22.86 90 top
SW-9  28.96,44.45 90 top
SW-9_CAP  18.03,33.66 90 top
SW-C  18.03,55.24 270 top
SW-C_CAP  7.11,55.24 90 top
SW-DIV  39.88,33.66 90 top
SW-DIV_CAP  39.88,22.86 90 top
SW-DWN  7.11,12.06 90 top
SW-DWN_CAP  28.96,22.86 90 top
SW-E  28.96,12.06 90 top
SW-E_CAP  28.96,44.45 90 top
SW-MINUS  39.88,12.06 90 top
SW-MINUS_CAP  39.88,33.66 90 top
SW-MULT  39.88,44.45 90 top
SW-MULT_CAP  39.88,12.06 0 top
SW-PLUS  39.88,22.86 90 top
SW-PLUS_CAP  28.96,33.66 90 top
SW-UP  7.11,55.24 90 top
SW-UP_CAP  28.96,12.06 0 top
T1  21.59,98.42 0 top
T2  29.21,98.42 0 top
T3  13.97,98.42 0 top
T4  17.78,98.42 0 top
T5  25.4,98.42 0 top
T6  10.16,98.42 0 top
T7  36.83,98.42 0 top
T8  33.02,98.42 0 top
T9  8.26,101.92 0 top
T10  12.06,101.92 0 top
T11  15.88,101.92 0 top
T12  19.68,101.92 0 top
T13  23.5,101.92 0 top
T14  27.3,101.92 0 top
T15  31.11,101.92 0 top
T16  34.92,101.92 0 top
T17  38.73,101.92 0 top
TC1  3.17,67.31 270 top
U2  40.01,79.38 0 top
U3  38.73,71.75 0 top
U4  13.97,74.93 90 top
U5  28.57,73.66 90 top
U$17  [LOGO_PLH_2700]  23.18,42.55 270 bottom
U$50  [HOLE_3-48]  12.57,49.78 0 top
U$51  [HOLE_3-48]  12.45,17.53 0 top
U$52  [HOLE_3-48]  34.42,17.53 0 top
U$53  [HOLE_3-48]  34.42,49.78 0 top
U$54  [HOLE_3-48]  38.1,89.53 0 top
U$55  [HOLE_3-48]  8.89,89.53 0 top
X2  8.26,67.31 180 top

### Tracks (layer width: path | path; a pad name or v marks a point on that pad's centre or on a via)
!RESET
  Top 0.254: U4.40 9.75,76.2 7.3,76.2 6.67,76.83 2.22,76.83 0.95,75.56 0.95,69.53 1.91,68.58 TC1.1
+3V3  (via drill 0.3)
  Top 0.254: U4.44 7.19,74.18 v6.35,73.34 C5.1 | U4.6 13.72,67.24 v13.97,66.99 C9.1 | U4.36 11.22,80.22 10.16,81.28 v7.3,81.28 C11.1 | U4.17 19.48,74.18 v19.68,73.98 20,73.66 C10.1 | TC1.2 4.45,68.58 v4.76,68.9 | C15.1 v26.67,79.06 | v26.67,79.06 U5.8 | U5.7 27.94,78.42 27.3,79.06 v26.67,79.06 | U5.3 v29.21,68.58
  Top 0.305: T9.1 8.22,100.97 v7.3,100.97 | T17.1 38.44,100.9 37.78,101.56 v37.78,101.6 | T16.1 34.63,100.9 33.97,101.56 v33.97,101.6 | T15.1 30.82,100.9 30.16,101.56 v30.16,101.6 | T14.1 27.01,100.9 26.35,101.56 v26.35,101.6 | T13.1 23.2,100.9 22.54,101.56 v22.54,101.6 | T12.1 19.39,100.9 18.73,101.56 v18.73,101.6 | T11.1 15.58,100.9 14.92,101.56 v14.92,101.6 | T10.1 11.77,100.9 11.11,101.56 v11.11,101.6 | R1.1 36.51,83.05 v36.51,81.6
  Top 0.406: v33.97,81.6 C7.1 36.41,80.22 C8.1 | v36.51,81.6 C8.1 | C8.1 37.78,80.33 38.13,80.67 U2.5
  other vias: 38.1,80.64
  pour Route15 (isolate 0.305): 0.64,107.31 0.64,0.64 31.75,0.64 31.75,70.48 40.64,79.38 43.18,79.38 46.35,82.55 46.35,107.31
A
  Top 0.305: J2.8 21.5,94.34 21.53,94.34 R5.1
AREF
  Top 0.254: U4.4 12.72,67.55 12.06,66.89 C14.1
B
  Top 0.305: J2.14 27.5,93.53 28.4,94.44 29.17,94.44 R6.1
C
  Top 0.305: J2.4 17.5,91.72 14.78,94.44 14.01,94.44 R9.1
CA1
  Top 0.305: R15.1 7.94,103.56 T9.2 6.51,102.13 6.51,98.9 8.73,96.68 8.73,93.66 9.53,92.87 11.11,92.87 12.22,91.76 13.34,91.76 14.13,90.96 14.13,89.38 15.49,88.01 J2.1
CA2
  Top 0.305: T10.2 11.25,103.05 | 11.25,103.05 11.75,103.56 R16.1 | J2.3 17.5,87.98 18.41,88.9 18.41,92.39 17.62,93.19 16.99,93.19 15.4,94.77 15.4,97.47 13.97,98.9 13.97,100.01 13.34,100.65 13.34,101.28 12.7,101.92 12.06,101.92 11.25,102.74 11.25,103.05
CA3
  Top 0.305: R17.1 15.56,103.56 T11.2 14.94,102.86 15.88,101.92 16.51,101.92 17.14,101.28 17.14,100.65 17.78,100.01 17.78,99.06 19.05,97.79 19.05,95.25 20.48,93.82 20.48,89.06 19.5,88.08 J2.5
CA4
  Top 0.305: R18.1 19.37,103.56 T12.2 19.76,101.92 20.48,101.92 20.95,101.44 20.95,100.81 21.59,100.17 21.59,98.9 22.86,97.63 22.86,93.34 22.54,93.03 22.54,89.22 21.5,88.17 J2.7
CA5  (via drill 0.3)
  Top 0.305: T13.2 23.18,103.56 R19.1 22.72,104.28 22.23,104.78 22.23,105.41 v21.59,106.05 | J2.9 v23.5,88.58
  Bottom 0.305: v23.5,88.58 23.5,97 24.77,98.27 24.77,99.06 23.5,100.33 23.5,102.55 22.23,103.82 22.23,105.41 v21.59,106.05
CA6
  Top 0.305: R20.1 26.99,103.56 T14.2 25.4,101.97 25.4,101.28 25.08,100.97 25.08,100.33 25.4,100.01 25.4,98.9 24.13,97.63 24.13,93.34 24.61,92.87 24.61,89.06 25.5,88.17 J2.11
CA7
  Top 0.305: R21.1 30.8,103.56 T15.2 29.21,101.97 29.21,101.28 28.89,100.97 28.89,100.33 29.21,100.01 29.21,98.9 27.94,97.63 27.94,95.25 26.51,93.82 26.51,89.38 27.5,88.39 J2.13
CA8
  Top 0.305: R22.1 34.61,103.56 T16.2 33.02,101.97 33.02,101.28 32.7,100.97 32.7,100.33 33.02,100.01 33.02,99.06 31.75,97.79 31.75,94.93 30,93.19 29.05,93.19 28.42,92.55 28.42,89.06 29.5,87.98 J2.15
CA9
  Top 0.305: R23.1 38.42,103.56 T17.2 38.2,102.93 40.01,101.12 40.01,98.74 38.26,97 38.26,93.5 37.62,92.87 35.72,92.87 33.02,90.17 33.02,89.53 31.5,88.01 J2.17
D
  Top 0.305: J2.6 19.5,93.53 18.59,94.44 17.82,94.44 R10.1
D0  (via drill 0.3)
  Top 0.254: U4.16 16.81,73.68 15.88,74.61 v15.88,74.93
  Top 0.305: T2.3 30.2,100.29 v29.84,100.65
  Route2 0.254: v15.88,74.93 16.83,75.88 16.83,79.69 19.37,82.23 20.64,82.23 22.54,84.14 v24.13,84.14
  Bottom 0.254: 27.3,87.31 v24.13,84.14
  Bottom 0.305: v29.84,100.65 29.84,97.79 27.3,95.25 27.3,87.31
D1  (via drill 0.3)
  Top 0.254: U4.15 16.36,73.18 14.92,74.61 v14.92,75.25
  Top 0.305: T5.3 26.39,100.29 v26.04,100.65
  Route15 0.254: v14.92,75.25 16.83,77.15 16.83,79.69 v20.32,83.19
  Bottom 0.254: 25.4,88.27 v20.32,83.19
  Bottom 0.305: v26.04,100.65 26.04,97.16 25.4,96.52 25.4,88.27
D2  (via drill 0.3)
  Top 0.254: U4.23 19.39,77.18 v20.32,78.11 | v4.89,22.86 4.86,22.86 | 20.28,55.24 v20.26,55.24
  Top 0.305: T9.3 9.53,103.21 v9.53,104.14 | SW-1.B 4.86,22.86 SW-1.B' | SW-C.B' 20.28,55.24 SW-C.B
  Route15 0.254: v20.32,78.11 18.73,76.52 18.73,56.77 v20.26,55.24
  Bottom 0.254: v20.32,78.11 20,77.79 16.51,77.79 11.75,82.55 11.75,87.63 | v4.89,22.86 7.05,22.86 20.26,36.07 v20.26,55.24
  Bottom 0.305: v9.53,104.14 9.53,99.69 10.16,99.06 10.16,97.16 11.75,95.57 11.75,87.63
D3  (via drill 0.3)
  Top 0.254: U4.14 20.66,72.68 v21.59,71.75 | v29.34,50.1 29.27,50.16 22.16,50.16 v21.84,49.85 | v13.65,87.63 11.43,87.63 9.21,85.41 9.21,83.82 v10.48,82.55 | v15.81,33.66 18.03,31.43 v18.03,29.84
  Top 0.305: T10.3 13.34,103.21 v13.34,104.14 | 15.78,33.66 SW-5.B | SW-5.B' 15.78,33.66 | 37.63,33.66 SW-DIV.B | SW-DIV.B' 37.63,33.66 | v15.81,33.66 15.78,33.66 | v37.66,33.66 37.63,33.66
  Bottom 0.254: v37.66,33.66 38.61,34.61 38.61,40.2 38.61,43.81 37.97,44.45 34.29,44.45 29.34,49.4 v29.34,50.1 29.21,50.23 29.21,63.82 21.59,71.44 v21.59,71.75 21.59,73.03 18.41,76.2 14.29,76.2 10.48,80.01 v10.48,82.55 | v18.03,29.84 21.84,33.66 v21.84,49.85
  Bottom 0.305: v13.34,104.14 13.65,103.82 v13.65,87.63
D4  (via drill 0.3)
  Top 0.254: U4.13 19.89,72.18 v20.95,71.12 21.27,70.8 22.86,70.8 25.4,73.34 25.4,81.6 22.86,84.14 v17.14,84.14 | v26.73,33.66 26.71,33.66
  Top 0.305: T11.3 17.14,103.21 v17.14,104.14 | SW-6.B 26.71,33.66 SW-6.B' | v37.66,43.31 37.63,43.33 | SW-MULT.B 37.63,43.28 v37.66,43.31 | 37.63,43.33 v37.66,43.31 | SW-MULT.B' 37.63,43.33
  Bottom 0.254: v20.95,71.12 28.26,63.82 28.26,53.85 28.26,48.9 | v37.66,43.31 33.85,43.31 28.26,48.9 | v26.73,33.66 24.61,35.78 24.61,45.24 28.26,48.9 | 18.41,85.41 v17.14,84.14
  Bottom 0.305: v17.14,104.14 17.14,100.33 18.41,99.06 18.41,85.41
D5  (via drill 0.3)
  Top 0.254: U4.24 18.17,79.3 v18.1,79.38
  Top 0.305: T1.3 22.58,100.29 v22.23,100.65
  Bottom 0.254: v18.1,79.38 17.46,80.01 17.46,82.23 22.23,87
  Bottom 0.305: v22.23,100.65 22.23,87
D6  (via drill 0.3)
  Top 0.254: U4.29 14.72,81.48 v12.7,83.5
  Top 0.305: T6.3 11.15,98.39 v11.43,98.11
  Bottom 0.305: v11.43,98.11 11.43,97.16 12.7,95.89 v12.7,83.5
D7  (via drill 0.3)
  Top 0.254: U4.30 14.22,81.03 v12.7,82.55 | v26.73,44.45 26.71,44.45 | v21.84,25.08 23.5,26.73 23.5,37.4 26.54,40.45 SW-9.B
  Top 0.305: T14.3 28.57,103.21 v28.57,104.14 | SW-0.B 15.78,9.87 v15.49,10.16 | SW-0.B' 15.78,14.26 v15.49,13.97 | SW-9.B 26.71,44.45 SW-9.B'
  Route15 0.254: v26.73,44.45 24.77,44.45 10.16,59.05 10.16,78.42 12.7,80.96 v12.7,82.55
  Bottom 0.254: v21.84,25.08 21.84,20.32 v15.49,13.97 | 26.35,87.63 19.68,80.96 19.68,79.38 18.73,78.42 16.83,78.42 v12.7,82.55
  Bottom 0.305: v15.49,13.97 v15.49,10.16 | v28.57,104.14 28.57,97.79 26.35,95.57 26.35,87.63
D8/A6  (via drill 0.3)
  Top 0.254: U4.11 16.22,69.82 17.78,68.26 v17.78,66.67 R4.1 | v15.88,60.96 15.88,59.52 SW-C.A | SW-UP.A 8.06,49.85 8.06,17.46 SW-DWN.A'
  Top 0.305: SW-MULT.A' SW-MULT.A SW-DIV.A' SW-DIV.A SW-PLUS.A' SW-PLUS.A SW-MINUS.A' 42.13,12.09 42.1,12.06 | SW-DWN.A' 9.36,12.06 | 9.36,12.06 SW-DWN.A | 42.1,12.06 31.18,12.06 | 31.18,12.06 20.26,12.06 | 20.26,12.06 9.36,12.06 | SW-MINUS.A 42.13,12.04 42.1,12.06 | SW-E.A' 31.21,12.09 31.18,12.06 | SW-E.A 31.21,12.04 31.18,12.06 | SW-0.A' 20.28,12.09 20.26,12.06 | SW-0.A 20.28,12.04 20.26,12.06 | SW-UP.A' 9.36,55.24 | 9.36,55.24 SW-UP.A | SW-C.A 15.78,55.24 | 15.78,55.24 SW-C.A' | 15.78,55.24 9.36,55.24
  Bottom 0.254: v17.78,66.67 15.88,64.77 v15.88,60.96
D9/A7  (via drill 0.3)
  Top 0.254: U4.12 16.72,69.96 19.68,66.99 v19.68,66.67 R3.1 | SW-7.A' 9.4,48.61 9.4,46.67 v10.29,46.67
  Top 0.305: SW-7.A' SW-7.A SW-4.A' SW-4.A SW-1.A' 9.36,22.86 | 9.36,22.86 SW-1.A | 20.28,22.86 SW-2.A' SW-5.A SW-5.A' SW-8.A SW-8.A' | 20.28,22.86 SW-2.A | 31.21,22.86 SW-3.A | 31.21,22.86 SW-3.A' SW-6.A SW-6.A' SW-9.A SW-9.A' | 20.28,22.86 9.36,22.86 | 31.21,22.86 20.28,22.86
  Bottom 0.254: v19.68,66.67 18.73,65.72 18.73,58.8 13.4,53.47 11.3,53.47 8.76,50.93 8.76,49.85 8.76,48.07 10.16,46.67 v10.29,46.67
D10  (via drill 0.3)
  Top 0.254: U4.27 15.72,81.44 v13.65,83.5
  Top 0.305: T3.3 14.96,100.29 v14.61,100.65
  Bottom 0.305: 14.61,84.45 v14.61,100.65 | v13.65,83.5 14.61,84.45 | 14.61,84.45
D11  (via drill 0.3, 0.35)
  Top 0.254: U4.25 16.72,79.9 17.14,80.33 v20.64,80.33 | v37.66,22.86 37.63,22.86 | v35.24,53.98 40.01,49.21 40.01,44.45 | v32.7,82.55 32.7,76.83 33.66,75.88 33.66,65.41 v32.7,64.45 | v25.4,84.14 25.72,84.45 27.3,84.45 v27.94,83.82 | 37.34,26.99 37.5,26.99 SW-PLUS.B' 40.01,29.44 40.01,44.45 | 40.01,44.45
  Top 0.305: T16.3 36.2,103.21 v36.2,104.14 | SW-PLUS.B 37.63,22.86 37.63,26.43 SW-PLUS.B' | SW-3.B 26.71,20.66 v26.42,20.95 | SW-3.B' 26.71,25.05 v26.42,24.77
  Bottom 0.254: v37.66,22.86 26.42,22.86 | v36.2,104.14 33.97,104.14 33.02,105.09 32.07,105.09 31.11,104.14 31.11,99.38 30.48,98.74 30.48,96.84 27.94,94.3 27.94,86.68 v25.4,84.14 21.59,80.33 v20.64,80.33 | v35.24,53.98 35.24,54.61 32.07,57.78 32.07,63.82 v32.7,64.45 | v32.7,82.55 29.21,82.55 v27.94,83.82
  Bottom 0.305: v26.42,20.95 26.42,22.86 v26.42,24.77
D12  (via drill 0.3)
  Top 0.254: U4.28 15.22,77.77 v14.61,77.15 12.7,75.25 v12.7,74.93 | v4.89,33.66 4.86,33.66 | v28.57,66.67 v20.95,66.67
  Top 0.305: T17.3 40.01,103.21 v40.01,104.14 | SW-4.B 4.86,33.66 SW-4.B' | SW-MINUS.B 37.63,9.87 v37.34,10.16 | SW-MINUS.B' 37.63,14.26 v37.34,13.97
  Bottom 0.254: v12.7,74.93 v20.95,66.67 20.57,66.29 20.57,57.47 18.67,55.56 18.67,44.32 8,33.66 v4.89,33.66 3.94,32.7 3.94,10.16 7.43,6.67 25.15,6.67 28.64,10.16 v37.34,10.16 | 34.61,87.63 34.61,83.19 31.43,80.01 31.43,67.94 30.16,66.67 v28.57,66.67
  Bottom 0.305: v37.34,13.97 v37.34,10.16 | v40.01,104.14 40.01,99.06 34.61,93.66 34.61,87.63
D13
  Top 0.254: U4.26 16.22,80.36 17.14,81.28 R7.1
D14/A0  (via drill 0.3)
  Top 0.254: U4.3 12.22,68.73 v11.43,67.94
  Top 0.305: T7.3 37.82,100.29 v37.47,100.65
  Route2 0.254: v11.43,67.94 25.4,81.92 30.16,81.92 v32.07,83.82
  Bottom 0.254: 33.34,85.09 v32.07,83.82
  Bottom 0.305: v37.47,100.65 37.47,97.79 33.34,93.66 33.34,85.09
D15/A1  (via drill 0.3)
  Top 0.254: U4.7 14.22,68.02 14.43,67.82 14.43,67.81 14.92,67.31 14.92,62.55 v13.97,61.59 13.34,60.96 7.81,60.96 6.16,59.31 6.16,17.46 SW-DWN.B' | v15.88,77.15 13.97,75.25 v13.97,72.39
  Top 0.305: T15.3 32.38,103.21 v32.38,104.14 | 4.86,12.06 SW-DWN.B | SW-DWN.B' 4.86,12.06 | SW-2.B 15.78,20.66 v15.49,20.95 | SW-2.B' 15.78,25.05 v15.49,24.77 | v4.89,12.06 4.86,12.06
  Bottom 0.254: v15.49,20.95 9.65,20.95 4.89,16.19 v4.89,12.06 | 28.57,87.63 28.57,86.36 21.27,79.06 21.27,78.11 20.32,77.15 v15.88,77.15 | v13.97,72.39 14.92,71.44 14.92,62.55 v13.97,61.59
  Bottom 0.305: v15.49,24.77 v15.49,20.95 | 28.57,87.63 28.57,93.98 32.38,97.79 v32.38,104.14
D16/A2  (via drill 0.3)
  Top 0.254: U4.8 14.72,68.47 15.56,67.63 15.56,61.91 v14.61,60.96 | v15.81,44.45 15.78,44.45 | v18.41,82.23 16.19,82.23 13.97,84.45 v10.79,84.45
  Top 0.305: T13.3 24.77,103.21 v24.77,104.14 | SW-E.B 26.71,9.87 v26.42,10.16 | SW-E.B' 26.71,14.26 v26.42,13.97 | SW-8.B 15.78,44.45 SW-8.B'
  Route15 0.254: v26.42,13.97 26.42,18.99 16.76,28.64 16.76,43.5 v15.81,44.45
  Bottom 0.254: 13.24,60.1 10.16,57.02 4.13,57.02 3.11,56.01 3.11,51.12 9.78,44.45 v15.81,44.45 | v14.61,60.96 13.75,60.1 13.24,60.1 | 24.45,88.27 v18.41,82.23 | v10.79,84.45 9.53,83.19 9.53,63.82 12.73,60.61 12.86,60.48 13.24,60.1
  Bottom 0.305: v26.42,13.97 v26.42,10.16 | v24.77,104.14 24.77,100.33 25.4,99.69 25.4,97.79 24.45,96.84 24.45,88.27
D17/A3  (via drill 0.3)
  Top 0.254: U4.9 15.22,68.92 16.19,67.94 16.19,62.23 v17.46,60.96 27.94,60.96 33.02,66.04 33.02,75.56 32.07,76.52 32.07,81.92 28.89,85.09 20.95,85.09 20.64,85.41 20.64,88.27 21.27,88.9 v21.27,89.22 | v4.89,55.24 4.86,55.24 | v4.89,44.45 4.86,44.45
  Top 0.305: T12.3 20.95,103.21 v20.95,104.14 | SW-UP.B' 4.86,56.01 4.86,55.24 SW-UP.B SW-7.B' 4.86,44.45 SW-7.B
  Bottom 0.254: v17.46,60.96 17.46,59.69 13.02,55.24 v4.89,55.24
  Bottom 0.305: v20.95,104.14 21.27,103.82 v21.27,89.22
D18/A4  (via drill 0.3)
  Top 0.254: U4.10 15.72,69.37 16.83,68.26 16.83,62.87 v17.78,61.91 27.94,61.91 32.38,66.36 32.38,75.25 31.43,76.2 31.43,81.6 v29.53,83.5
  Top 0.305: T8.3 34.01,100.29 v33.66,100.65
  Bottom 0.254: 32.38,86.36 v29.53,83.5
  Bottom 0.305: v33.66,100.65 33.66,97.47 32.38,96.2 32.38,86.36
D19/A5  (via drill 0.3)
  Top 0.254: U4.47 8.86,72.68 8.26,72.07 8.26,70.48 v8.57,70.17 | v17.14,83.19 16.51,83.19 13.97,85.72 v10.79,85.72
  Top 0.305: T4.3 18.77,100.29 v18.41,100.65
  Bottom 0.254: v8.57,70.17 8.57,83.82 10.48,85.72 v10.79,85.72 | 19.37,85.09 17.46,83.19 v17.14,83.19
  Bottom 0.305: v18.41,100.65 19.37,99.69 19.37,85.09
D22/MISO  (via drill 0.3)
  Top 0.203: U4.21 20.3,76.18 20.95,76.83 v21.27,76.83
  Top 0.254: U5.2 v27.94,68.58
  Bottom 0.254: v27.94,68.58 27.94,68.26 27.3,67.63 26.35,67.63 25.08,68.9 25.08,73.03 v21.27,76.83
D23/MOSI  (via drill 0.3)
  Top 0.203: U4.19 20.57,75.18 20.95,75.56 22.86,75.56 v24.13,76.83
  Top 0.254: U5.5 v30.48,78.74
  Bottom 0.203: v30.48,78.74 29.84,78.11 28.26,78.11 26.99,76.83 v24.13,76.83
D24/SCK  (via drill 0.3)
  Top 0.203: U4.20 20.43,75.68 20.95,76.2 22.54,76.2 v23.18,76.83
  Top 0.254: U5.6 v29.21,78.74
  Bottom 0.203: v29.21,78.74 27.94,78.74 26.67,77.47 23.81,77.47 v23.18,76.83
D39/!MEM_CS  (via drill 0.3)
  Top 0.203: U4.22 20.16,76.68 20.95,77.47 21.59,77.47 v22.23,76.83
  Top 0.254: U5.1 v26.67,68.58
  Bottom 0.254: v26.67,68.58 25.72,69.53 25.72,73.34 v22.23,76.83
DP
  Top 0.305: J2.16 29.5,91.72 32.21,94.44 32.98,94.44 R14.1
E
  Top 0.305: J2.12 25.5,94.34 25.46,94.34 R11.1
EXTAL32
  Top 0.254: C2.1 7.3,67.06 X2.P$1 7.05,67.38 8.57,68.9 10.16,68.9 11.22,69.96 U4.1
F
  Top 0.305: J2.2 15.49,91.82 14.61,92.71 12.7,92.71 10.97,94.44 10.2,94.44 R12.1
G
  Top 0.305: J2.18 31.5,91.82 32.38,92.71 34.29,92.71 36.02,94.44 36.79,94.44 R13.1
GND  (via drill 0.3)
  Top 0.254: U4.42 7.37,75.18 v6.99,75.56 | C2.2 v7.3,61.91 | C4.2 v9.21,61.91 | C14.2 v12.06,62.55 | C9.2 v13.97,62.55 | R4.2 v17.78,62.87 | R3.2 v19.68,62.87 | U4.5 13.22,66.88 v13.02,66.67 | C5.2 v1.91,73.34 | C1.2 v1.91,75.25 | v2.86,81.28 C11.2 | HB.C v20.64,79.38 | C10.2 22.86,73.56 22.86,72.71 v23.18,72.39 | U4.35 11.72,80.99 v11.43,81.28 | U4.18 21.34,74.68 v21.59,74.93 | TC1.3 v1.27,67.31 | U5.4 v30.48,68.58
  Top 0.305: R16.2 v11.75,107 | R15.2 v7.94,107 | R17.2 v15.56,107 | R18.2 v19.37,107 | R19.2 v23.18,107 | R20.2 v26.99,107 | R21.2 v30.8,107 | R22.2 v34.61,107 | R23.2 v38.42,107 | T6.2 9.22,98.44 v8.89,98.11 | T7.2 35.89,98.44 v35.56,98.11 | T8.2 32.08,99.23 v31.27,98.42 | T2.2 28.27,99.23 v27.46,98.42 | T5.2 24.46,99.23 v23.65,98.42 | T1.2 20.65,98.44 v20.32,98.11 | T4.2 16.84,98.44 v16.51,98.11 | T3.2 13.03,98.44 v12.7,98.11 | L1.C v43.5,83.19 | J3.5 24.8,4.79 v25.4,5.4 | C15.2 v26.67,83.5
  Top 0.406: C7.2 v33.97,77.15 | C8.2 v36.51,77.15 | U2.2 v40.01,76.2 | C6.2 v43.81,81.6 | R8.2 v35.56,69.53 | C3.2 v36.51,67.31 | U3.2 38.73,69.19 38.45,68.9 v38.42,68.9 | C12.2 v10.48,4.45 | C13.2 v10.16,1.91
  Top 0.508: J1.1 25.19,53.13 v25.08,53.02
  other vias: 27.3,74.61 27.3,72.71 29.84,72.71 29.84,74.61 28.57,73.66 34.92,68.26 34.92,74.3 36.83,74.3 36.83,71.75 34.92,66.36 7.75,53.66 7.11,44.45 17.4,45.72 28.96,44.45 28.96,33.66 7.11,21.59 7.11,10.79 18.03,13.34 18.03,21.59 18.03,35.56 7.11,35.56 28.96,21.59 14.1,58.1 1.27,12.7 45.72,12.7 45.72,22.86 1.27,22.86 1.27,33.02 1.27,43.18 45.72,43.18 45.72,33.02 1.27,55.88 45.72,52.07 6.67,96.52 40.32,96.52 34.29,33.66 34.29,39.37 12.51,42.86 12.51,33.66 12.51,24.45 24.57,48.26 34.42,24.77 34.1,7.94 24.89,28.26 21.72,28.26 25.4,63.82 40.32,63.5 40.64,86.68 6.35,87
  pour Route2 (isolate 0.254): -0.64,108.58 -0.64,-0.64 47.62,-0.64 47.62,108.58
  pour Top (isolate 0.254, rank 3): 39.05,74.93 39.05,66.04 34.29,66.04 34.29,74.93
  pour Bottom (isolate 0.254, rank 3): 39.05,74.93 39.05,66.04 34.29,66.04 34.29,74.93
  pour Top (isolate 0.254, rank 6): -0.64,108.58 -0.64,-0.64 47.62,-0.64 47.62,108.58
  pour Bottom (isolate 0.254, rank 6): -0.64,108.58 -0.64,-0.64 47.62,-0.64 47.62,108.58
  pour Top: 9.53,79.38 9.53,70.48 18.41,70.48 18.41,79.38
N$1
  Top 0.305: CHG.C 33.44,3.57 R2.1
N$2
  Top 0.305: HB.A 23.91,81.04 R7.2
N$3  (via drill 0.3)
  Top 0.305: U3.1 37.78,69.53 v37.47,69.22 | R2.2 v29.53,3.81
  Bottom 0.305: v29.53,3.81 33.53,3.81 40.51,10.79 40.51,48.9 36.83,52.58 36.83,64.14 37.47,64.77 v37.47,69.22
N$4
  Top 0.305: R8.1 36.05,73.06 U3.5
N$6
  Top 0.305: R1.2 L1.A
N$8
  Top 0.305: J3.1 22.2,5.11 21.59,5.71 17.78,5.71 16.83,4.76 F1.1
N$9
  Top 0.305: T1.1 21.61,96.09 R5.2
N$10
  Top 0.305: T2.1 29.23,96.09 R6.2
N$11
  Top 0.305: T3.1 13.99,96.09 R9.2
N$12
  Top 0.305: T4.1 17.8,96.09 R10.2
N$13
  Top 0.305: T5.1 25.43,96.09 R11.2
N$14
  Top 0.305: T6.1 10.19,96.09 R12.2
N$15
  Top 0.305: T7.1 36.85,96.09 R13.2
N$16
  Top 0.305: T8.1 33.05,96.09 R14.2
SWCLK  (via drill 0.3)
  Top 0.254: U4.45 7.96,73.68 6.99,72.71 6.99,71.44 v6.67,71.12 | TC1.5 v1.27,66.04
  Bottom 0.254: v1.27,66.04 2.54,67.31 4.76,67.31 6.67,69.22 v6.67,71.12
SWDIO
  Top 0.254: TC1.4 4.76,67.31 7.62,70.17 7.62,72.39 8.41,73.18 U4.46
USBD_N  (via drill 0.3)
  Top 0.203: J3.2 22.84,5.53 22.97,5.66 22.97,7.94 v22.72,7.94 | U4.33 12.72,77.74 13.18,77.28 13.18,76.68 12.72,76.22 12.34,76.22 v12.19,76.06
  Bottom 0.203: v22.72,7.94 22.91,7.94 22.97,7.87 22.97,65.64 12.34,76.28 12.19,76.12 v12.19,76.06
USBD_P  (via drill 0.3)
  Top 0.203: J3.3 23.5,5.51 23.38,5.63 23.38,7.94 v23.64,7.94 | U4.34 12.22,76.99 12.24,76.96 v12.4,76.96
  Bottom 0.203: v23.64,7.94 23.44,7.94 23.38,7.87 23.38,65.81 12.4,76.79 v12.4,76.96
VBAT  (via drill 0.3)
  Top 0.508: D1.A v33.34,53.66 32.81,53.13 J1.2
  Route15 0.813: v33.34,53.66 33.34,60.64 C3.1 v41.59,67.31
  other vias: 42.86,68.9 42.86,70.48 40.96,70.48 39.69,68.9 41.27,68.9
  pour Top (isolate 0.254, rank 2): 39.37,71.44 39.37,66.04 43.81,66.04 43.81,71.44
  pour Bottom (isolate 0.254, rank 2): 39.37,71.44 39.37,66.04 43.81,66.04 43.81,71.44
  pour Route15 (isolate 0.254, rank 2): 39.37,71.44 39.37,66.04 43.81,66.04 43.81,71.44
VBUS  (via drill 0.3, 0.39, 0.41)
  Top 0.406: CHG.A v29.84,1.91
  Top 0.508: D1.C 33.71,59 v35.56,57.15 36.51,56.2 S1.2
  Top 0.61: F1.2 v15.24,1.91 C13.1 13.55,2 C12.1
  Route15 1.016: v15.24,1.91 v29.84,1.91 30.99,1.91 39.88,10.79 39.88,49.4 45.09,54.61 | v35.56,57.15 36.83,55.88 45.09,55.88 45.09,54.61 | 45.09,54.61 45.09,71.75 44.13,72.71 v42.86,72.71
  other vias: 39.69,74.3 41.27,74.3 42.86,74.3 41.27,72.71
  pour Top (isolate 0.254): 39.05,74.93 39.05,72.07 43.81,72.07 43.81,74.93
  pour Bottom (isolate 0.254): 39.05,74.93 39.05,72.07 43.81,72.07 43.81,74.93
  pour Route15 (isolate 0.254): 39.05,74.93 39.05,72.07 43.81,72.07 43.81,74.93
VBUS_SW
  Top 0.508: C6.1 43.81,76.83 45.4,75.25 45.4,56.2 42.9,53.7 S1.1
  pour Top (isolate 0.254): 45.4,79.69 38.1,79.69 38.1,76.83 45.4,76.83
VDDCORE
  Top 0.254: U4.43 6.6,74.68 6.03,75.25 C1.1
XTAL32
  Top 0.254: C4.1 9.21,67.06 X2.P$2 9.53,67.31 11.72,69.5 U4.2